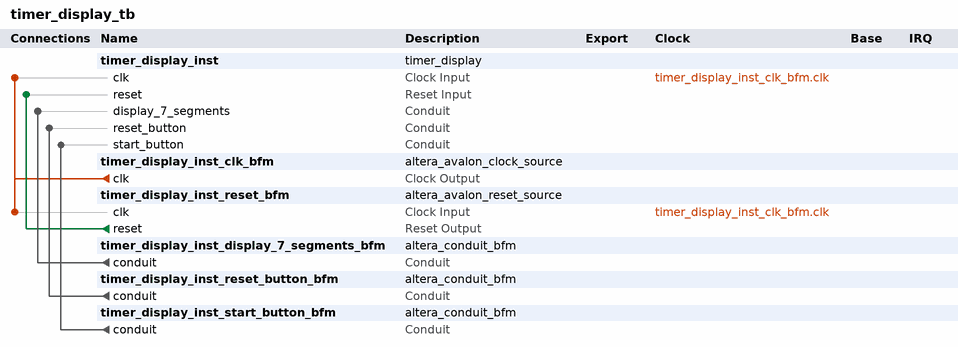
[diagram p0: system contents]
# Platform Designer (Qsys) system timer_display_tb, Cyclone V 5CSEMA5F31C6
# Parameters at their usual value, and those the tool derives, are not listed.
package require -exact qsys 18.1
create_system timer_display_tb
set_project_property DEVICE_FAMILY {Cyclone V}
set_project_property DEVICE 5CSEMA5F31C6

add_instance timer_display_inst timer_display 1.0

add_instance timer_display_inst_clk_bfm altera_avalon_clock_source 18.1

add_instance timer_display_inst_reset_bfm altera_avalon_reset_source 18.1
set_instance_parameter_value timer_display_inst_reset_bfm ASSERT_HIGH_RESET 0
set_instance_parameter_value timer_display_inst_reset_bfm INITIAL_RESET_CYCLES 50

add_instance timer_display_inst_display_7_segments_bfm altera_conduit_bfm 18.1
set_instance_parameter_value timer_display_inst_display_7_segments_bfm CLOCKED_SIGNAL false
set_instance_parameter_value timer_display_inst_display_7_segments_bfm ENABLE_RESET false
set_instance_parameter_value timer_display_inst_display_7_segments_bfm SIGNAL_DIRECTIONS input
set_instance_parameter_value timer_display_inst_display_7_segments_bfm SIGNAL_WIDTHS 28

add_instance timer_display_inst_reset_button_bfm altera_conduit_bfm 18.1
set_instance_parameter_value timer_display_inst_reset_button_bfm CLOCKED_SIGNAL false
set_instance_parameter_value timer_display_inst_reset_button_bfm ENABLE_RESET false
set_instance_parameter_value timer_display_inst_reset_button_bfm SIGNAL_DIRECTIONS output
set_instance_parameter_value timer_display_inst_reset_button_bfm SIGNAL_WIDTHS 1

add_instance timer_display_inst_start_button_bfm altera_conduit_bfm 18.1
set_instance_parameter_value timer_display_inst_start_button_bfm CLOCKED_SIGNAL false
set_instance_parameter_value timer_display_inst_start_button_bfm ENABLE_RESET false
set_instance_parameter_value timer_display_inst_start_button_bfm SIGNAL_DIRECTIONS output
set_instance_parameter_value timer_display_inst_start_button_bfm SIGNAL_WIDTHS 1

# connections
add_connection timer_display_inst_clk_bfm.clk timer_display_inst.clk clock
add_connection timer_display_inst_clk_bfm.clk timer_display_inst_reset_bfm.clk clock
add_connection timer_display_inst_reset_bfm.reset timer_display_inst.reset reset
add_connection timer_display_inst_display_7_segments_bfm.conduit timer_display_inst.display_7_segments conduit
add_connection timer_display_inst_reset_button_bfm.conduit timer_display_inst.reset_button conduit
add_connection timer_display_inst_start_button_bfm.conduit timer_display_inst.start_button conduit

set_interconnect_requirement {$system} qsys_mm.clockCrossingAdapter HANDSHAKE
set_interconnect_requirement {$system} qsys_mm.enableEccProtection FALSE
set_interconnect_requirement {$system} qsys_mm.insertDefaultSlave FALSE
set_interconnect_requirement {$system} qsys_mm.maxAdditionalLatency 1

save_system timer_display_tb.qsys
